# Altium project pumpPCB.PrjPcb
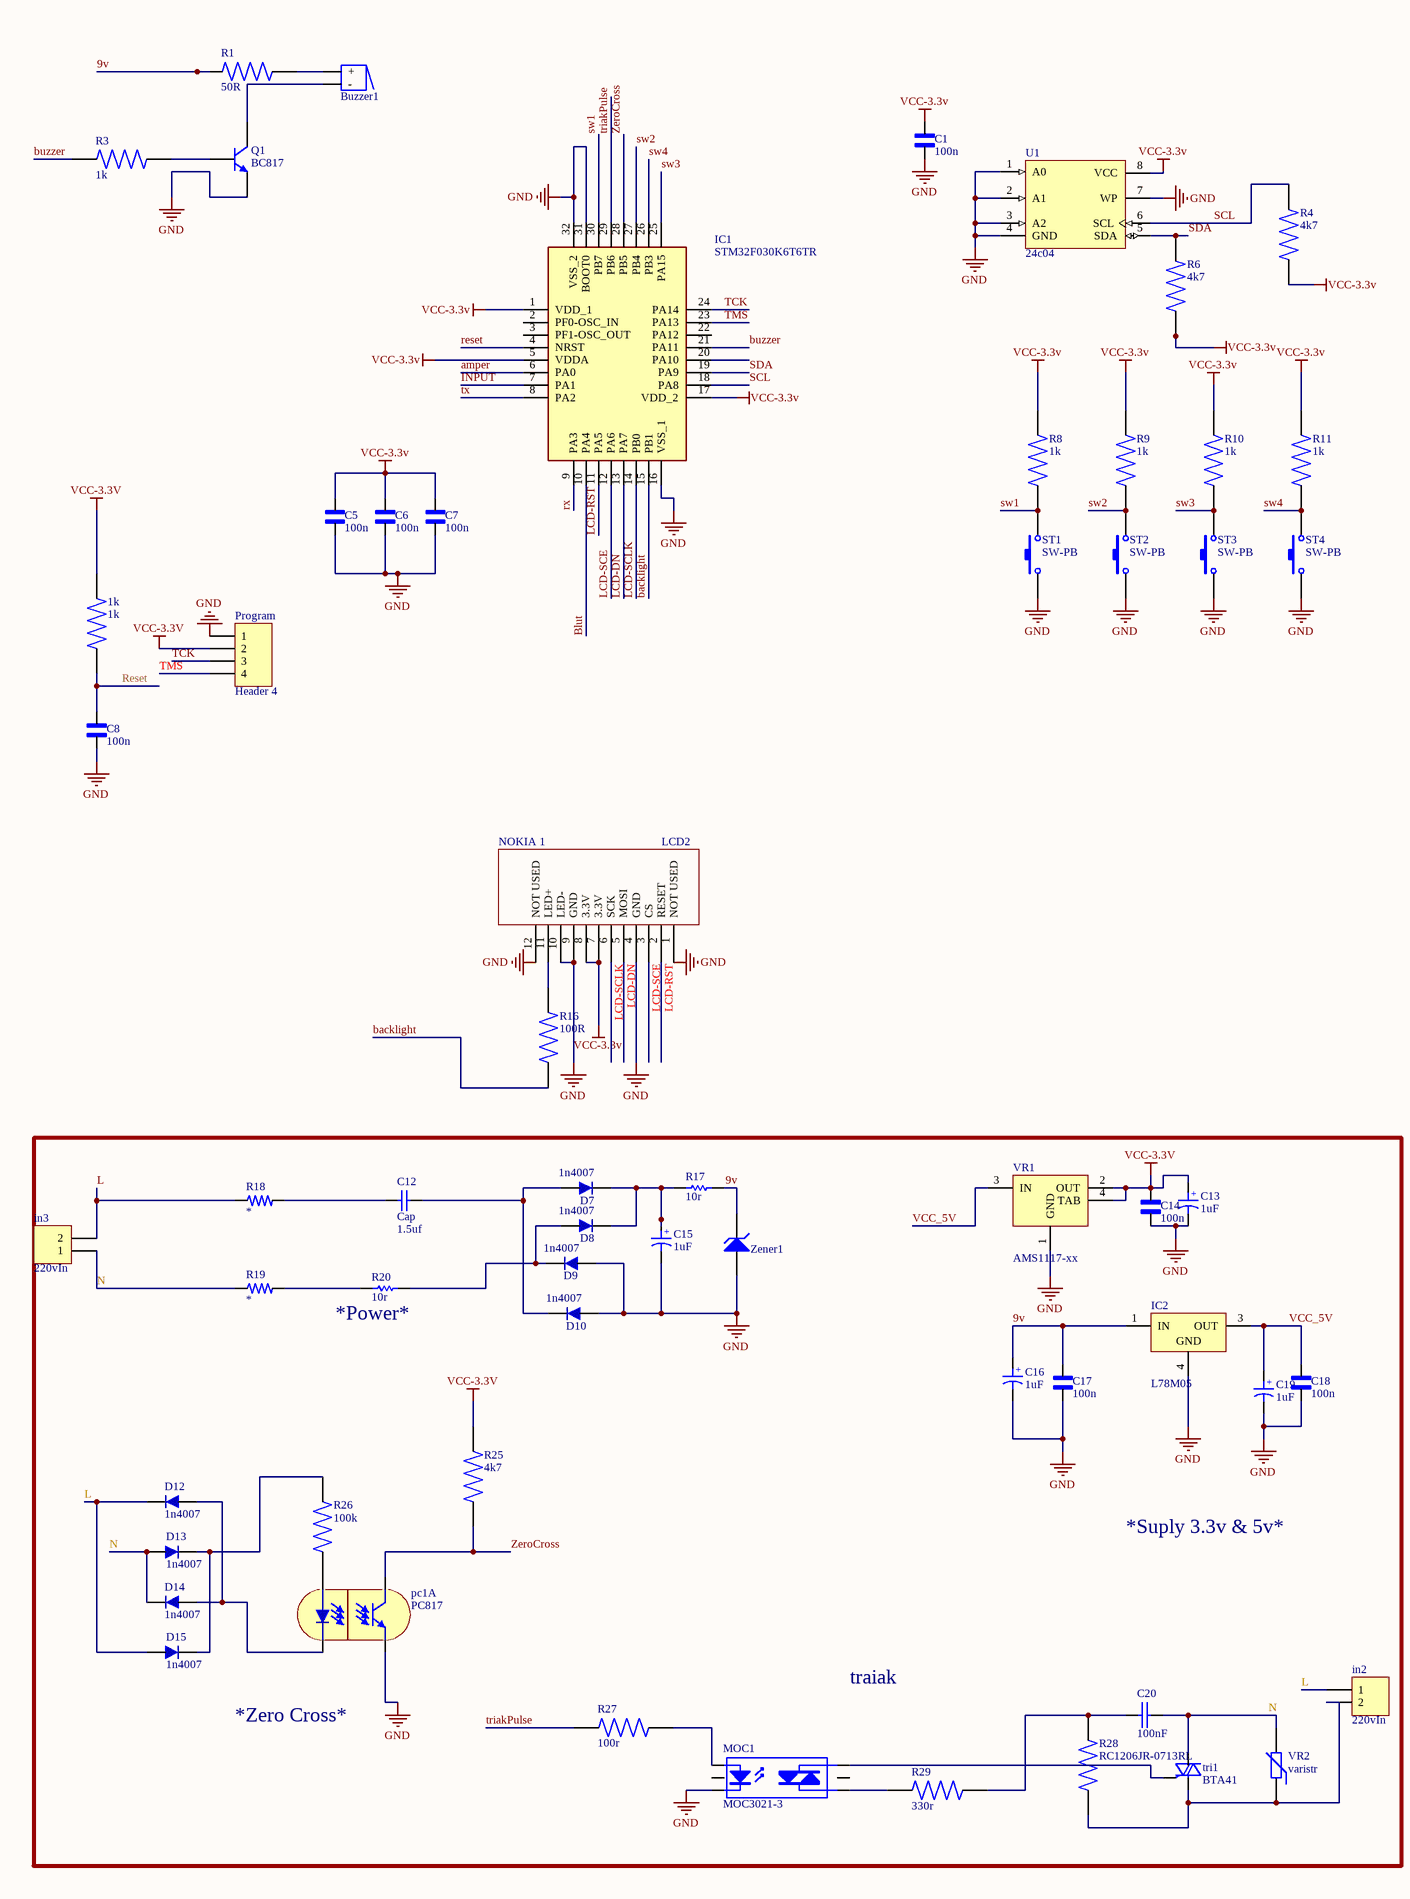
[diagram p0: LOAD CONTROL_Final2.SchDoc, left]
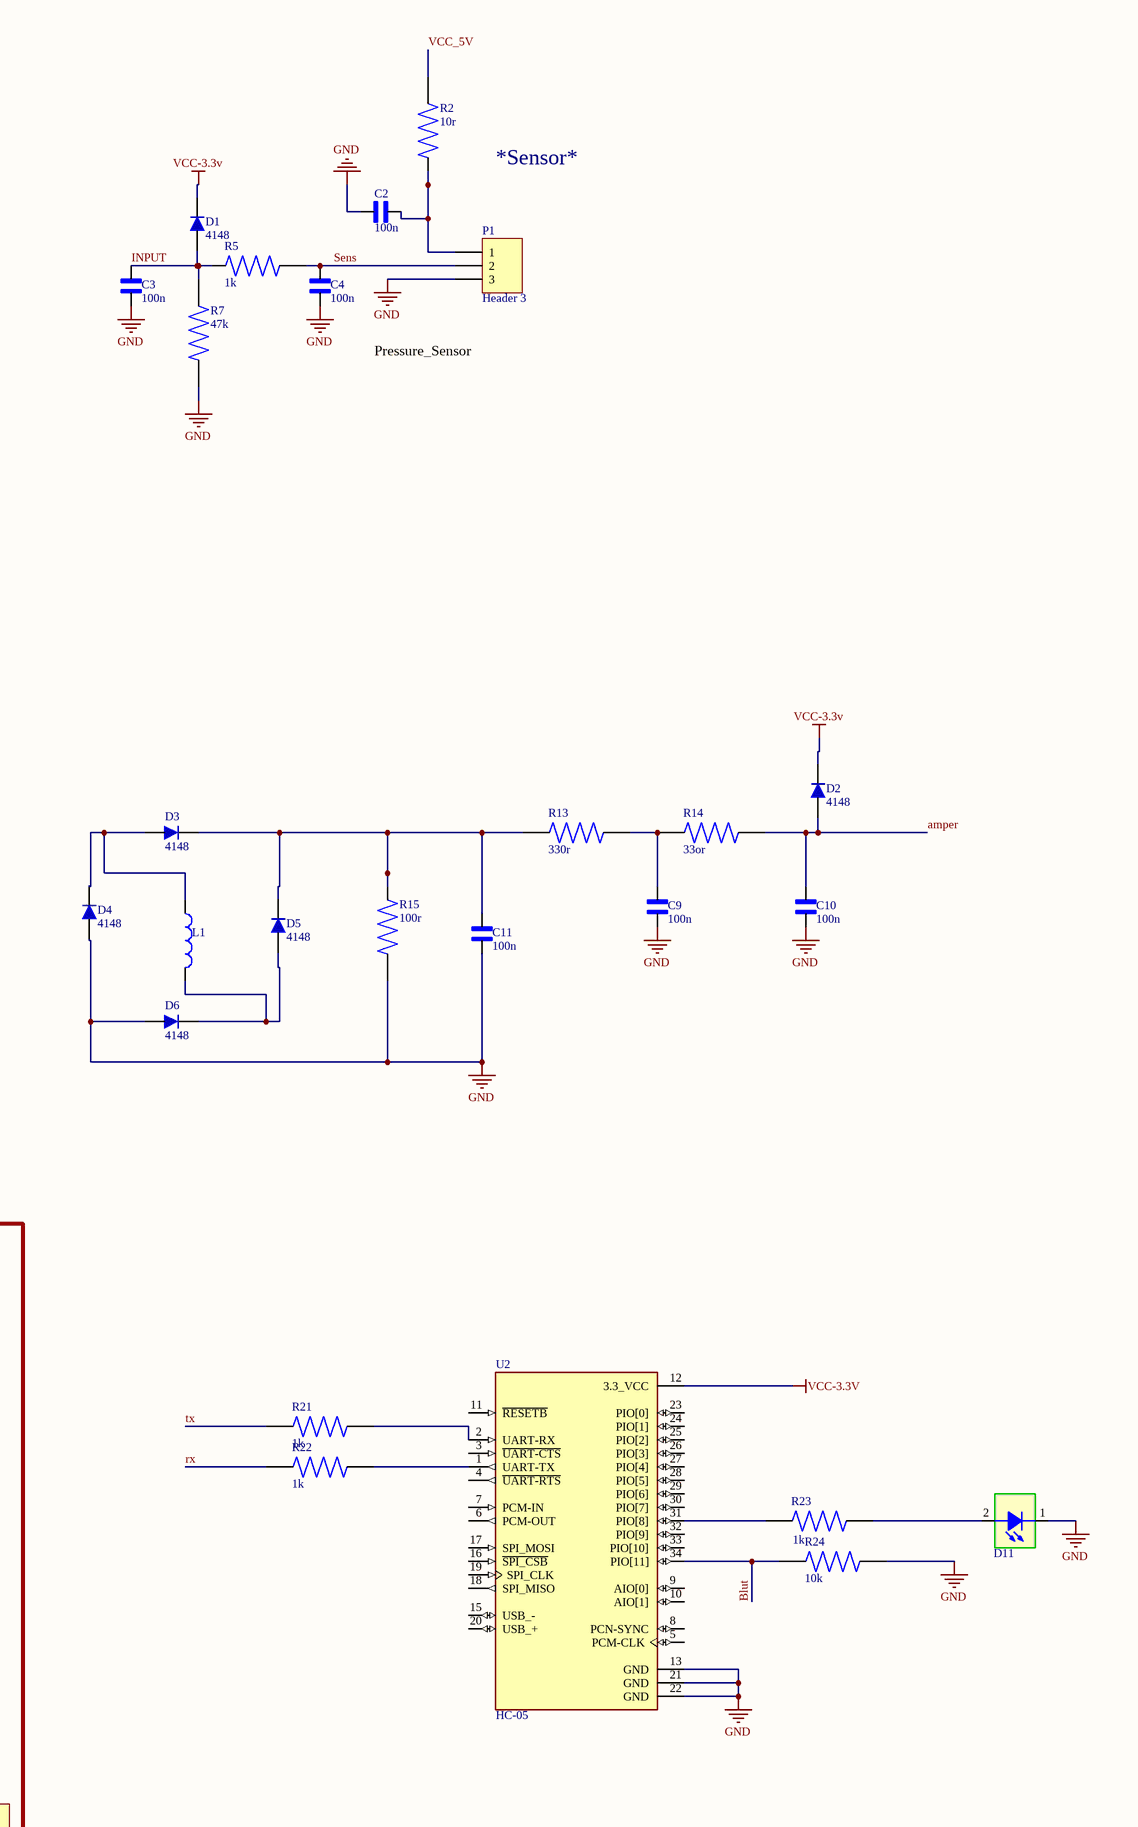
[diagram p1: LOAD CONTROL_Final2.SchDoc, right]
1 sheet, 86 parts. Net scope: global (net labels, ports and power ports of the same name join across sheets).
Board file: PumpControl.PcbDoc

## Sheet LOAD CONTROL_Final2.SchDoc
size A2

### Parts
1k  1k  [RESC3116X65N]
Buzzer1  Buzzer  [BUZZER]  (value not drawn)
C1  100n  [CAPC3216X88N]
C2  100n  [CAPC3216X88N]
C3  100n  [CAPC3216X88N]
C4  100n  [CAPC3216X88N]
C5  100n  [CAPC3216X88N]
C6  100n  [CAPC3216X88N]
C7  100n  [CAPC3216X88N]
C8  100n  [CAPC3216X88N]
C9  100n  [CAPC3216X88N]
C10  100n  [CAPC3216X88N]
C11  100n  [CAPC3216X88N]
C12  Cap  value 1.5uf  [RAD-0.3]
C13  1uF  [Cap electrolitic radial 5x11-2]
C14  100n  [CAPC3216X88N]
C15  1uF  [Cap electrolitic radial 5x11-2]
C16  1uF  [Cap electrolitic radial 5x11-2]
C17  100n  [CAPC3216X88N]
C18  100n  [CAPC3216X88N]
C19  1uF  [Cap electrolitic radial 5x11-2]
C20  100nF  [Cap 10nF]
D1  4148  [SOD80, LL-34]
D2  4148  [SOD80, LL-34]
D3  4148  [SOD80, LL-34]
D4  4148  [SOD80, LL-34]
D5  4148  [SOD80, LL-34]
D6  4148  [SOD80, LL-34]
D7  1n4007  [DIOM4629X24N]
D8  1n4007  [DIOM4629X24N]
D9  1n4007  [DIOM4629X24N]
D10  1n4007  [DIOM4629X24N]
D11  LED  [LED 1206]  (value not drawn)
D12  1n4007  [DIOM4629X24N]
D13  1n4007  [DIOM4629X24N]
D14  1n4007  [DIOM4629X24N]
D15  1n4007  [DIOM4629X24N]
IC1  STM32F030K6T6TR  [QFP80P900X900X160-32N]
IC2  L78M05  [TO-252]
in2  220vIn  [HDR1X2]
in3  220vIn  [HDR1X2]
L1  0  [ZMC]  (value not drawn)
MOC1  MOC3021-3  [DIP-6]
NOKIA_1  LCD2  [LCD NOKIA 1202]
P1  Header 3  [3PIN]
pc1  PC817  [SMT Gullwing Lead-Form]  (parts A,B of 2)
Program  Header 4  [HDR1X4]
Q1  BC817  [SOT23_N]
R1  50R  [RESC3116X65N]
R2  10r  [RESC3116X65N]
R3  1k  [RESC3116X65N]
R4  4k7  [RESC3116X65N]
R5  1k  [RESC3116X65N]
R6  4k7  [RESC3116X65N]
R7  47k  [RESC3116X65N]
R8  1k  [RESC3116X65N]
R9  1k  [RESC3116X65N]
R10  1k  [RESC3116X65N]
R11  1k  [RESC3116X65N]
R13  330r  [RESC3116X65N]
R14  33or  [RESC3116X65N]
R15  100r  [RESC3116X65N]
R16  100R  [RESC3116X65N]
R17  10r  [RES-(1/2)-Stand]
R18  100uh  [RESAD640W45L370D200]  (value not drawn)
R19  100uh  [RESAD640W45L370D200]  (value not drawn)
R20  10r  [RES-(1/2)-Stand]
R21  1k  [RESC3116X65N]
R22  1k  [RESC3116X65N]
R23  1k  [RESC3116X65N]
R24  10k  [RESC3116X65N]
R25  4k7  [RESC3116X65N]
R26  100k  [RESC3116X65N]
R27  100r  [RESC3116X65N]
R28  RC1206JR-0713RL  [RESC3116X65N]
R29  330r  [RESC3116X65N]
ST1  SW-PB  [PUSH BOTTOM 6*6]
ST2  SW-PB  [PUSH BOTTOM 6*6]
ST3  SW-PB  [PUSH BOTTOM 6*6]
ST4  SW-PB  [PUSH BOTTOM 6*6]
tri1  BTA41  [TO552P1530X450X2110-3B]
U1  24c04  [SO8_L]
U2  HC-05  [XCVR_HC-05]
VR1  AMS1117-xx  [SOT-223]
VR2  varistr  [14D XXX]
Zener1  9v  [Diode 1W_Stand]  (value not drawn)

### Nets
GND: C1.1 C2.2 C3.1 C4.1 C5.1 C6.1 C7.1 C8.1 C9.1 C10.1 C11.1 C13.2 C14.1 C15.2 C16.2 C17.1 C18.1 C19.2 D4.1 D6.1 D9.1 D10.1 D11.1 IC1.16(VSS_1) IC1.31(BOOT0) IC1.32(VSS_2) IC2.4(GND) MOC1.2(K) NOKIA_1.1(NOT_USED) NOKIA_1.4(GND) NOKIA_1.9(GND) NOKIA_1.10(LED-) NOKIA_1.12(NOT_USED) P1.3 pc1.3(E) Program.1 Q1.2(E) R7.1 R15.1 R24.1 ST1.1 ST2.1 ST3.1 ST4.1 U1.1(A0) U1.2(A1) U1.3(A2) U1.4(GND) U1.7(WP) U2.13(GND) U2.21(GND) U2.22(GND) VR1.1(GND) Zener1.1(A)
VCC-3.3v: 1k.2 C1.2 C5.2 C6.2 C7.2 C13.1 C14.2 D1.2 D2.2 IC1.1(VDD_1) IC1.5(VDDA) IC1.17(VDD_2) NOKIA_1.7(3.3V) NOKIA_1.8(3.3V) Program.2 R4.1 R6.1 R8.2 R9.2 R10.2 R11.2 R25.2 U1.8(VCC) U2.12(3.3_VCC) VR1.2(OUT) VR1.4(TAB)
9v: C16.1 C17.2 IC2.1(IN) R1.1 R17.2 Zener1.2(K)
amper: C10.2 D2.1 IC1.6(PA0) R14.1
backlight: IC1.15(PB1) R16.1
Blut: IC1.10(PA4) R24.2 U2.34(PIO[11])
buzzer: IC1.21(PA11) R3.1
INPUT: C3.2 D1.1 IC1.7(PA1) R5.2 R7.2
L: D12.2 D15.1 in2.1 in3.2 R18.1
LCD-DN: IC1.13(PA7) NOKIA_1.5(MOSI)
LCD-RST: IC1.11(PA5) NOKIA_1.2(RESET)
LCD-SCE: IC1.12(PA6) NOKIA_1.3(CS)
LCD-SCLK: IC1.14(PB0) NOKIA_1.6(SCK)
N: C20.2(-) D13.1 D14.2 in3.1 R19.1 tri1.2(A2) VR2.2
Reset: 1k.1 C8.2 IC1.4(NRST)
rx: IC1.9(PA3) R22.2
SCL: IC1.18(PA8) R4.2 U1.6(SCL)
SDA: IC1.19(PA9) R6.2 U1.5(SDA)
Sens: C4.2 P1.2 R5.1
sw1: IC1.30(PB7) R8.1 ST1.2
sw2: IC1.27(PB4) R9.1 ST2.2
sw3: IC1.25(PA15) R10.1 ST3.2
sw4: IC1.26(PB3) R11.1 ST4.2
TCK: IC1.24(PA14) Program.3
TMS: IC1.23(PA13) Program.4
triakPulse: IC1.29(PB6) R27.2
tx: IC1.8(PA2) R21.2
VCC_5V: C18.2 C19.1 IC2.3(OUT) R2.1 VR1.3(IN)
ZeroCross: IC1.28(PB5) pc1.4(C) R25.1
NetBuzzer1_1: Buzzer1.1(+) R1.2
NetBuzzer1_2: Buzzer1.2(-) Q1.3(C)
NetC2_1: C2.1 P1.1 R2.2
NetC9_2: C9.2 R13.1 R14.2
NetC11_2: C11.2 D3.2 D5.2 R13.2 R15.2
NetC12_1: C12.1 R18.2
NetC12_2: C12.2 D7.1 D10.2
NetC15_1: C15.1 D7.2 D8.2 R17.1
NetC20_1: C20.1(+) R28.1 R29.1
NetD3_1: D3.1 D4.2 L1.1
NetD5_1: D5.1 D6.2 L1.2
NetD8_1: D8.1 D9.2 R20.2
NetD11_2: D11.2 R23.1
NetD12_1: D12.1 D14.1 pc1.2(K)
NetD13_2: D13.2 D15.2 R26.2
Netin2_2: in2.2 R28.2 tri1.1(A1) VR2.1
NetMOC1_1: MOC1.1(A) R27.1
NetMOC1_4: MOC1.4(A/K) tri1.3(G)
NetMOC1_6: MOC1.6(A/K) R29.2
NetNOKIA_1_11: NOKIA_1.11(LED+) R16.2
Netpc1_1: pc1.1(A) R26.1
NetQ1_1: Q1.1(B) R3.2
NetR19_2: R19.2 R20.1
NetR21_1: R21.1 U2.2(UART-RX)
NetR22_1: R22.1 U2.1(UART-TX)
NetR23_2: R23.2 U2.31(PIO[8])

Not connected (* = marked no-connect by the designer): IC1 2(PF0-OSC_IN) 3(PF1-OSC_OUT) 20(PA10) 22(PA12); MOC1 3(NC) 5(NC); U2 3(~{UART-CTS}) 4(~{UART-RTS}) 5(PCM-CLK) 6(PCM-OUT) 7(PCM-IN) 8(PCN-SYNC) 9(AIO[0]) 10(AIO[1]) 11(~{RESETB}) 15(USB_-) 16(~{SPI_CSB}) 17(SPI_MOSI) 18(SPI_MISO) 19(SPI_CLK) 20(USB_+) 23(PIO[0]) 24(PIO[1]) 25(PIO[2]) 26(PIO[3]) 27(PIO[4]) 28(PIO[5]) 29(PIO[6]) 30(PIO[7]) 32(PIO[9]) 33(PIO[10])

### Notes on the sheet
- *Sensor*
- Pressure_Sensor
- (near R20) *Power*
- *Suply 3.3v & 5v*
- traiak
- *Zero Cross*
- (in symbol Cap ELECTROLITIC TOTAL SIZE) +

### Library data of the parts
1k R1-R11 R13-R16 R21-R29 = RC1206JR-0713RL: 13 Ohms Â±5% 0.25W, 1/4W Chip Resistor 1206 (3216 Metric) Moisture Resistant Thick Film; MF: Yageo; Check_prices: https://www.snapeda.com/parts/RC1206JR-0713RL/Yageo/view-part/?ref=eda; Value: *; Availability: In Stock; MP: RC1206JR-0713RL; Price: None; Package: 3116 Yageo; SnapEDA_Link: https://www.snapeda.com/parts/RC1206JR-0713RL/Yageo/view-part/?ref=snap; Purchase-URL: https://pricing.snapeda.com/search/part/RC1206JR-0713RL/?ref=eda
Buzzer1 = Buzzer: Designer: Seyed Mohsen Ghasemain; ComponentLinkURL: www.picpars.com
C1-C11 C14 C17 C18 = C1206C120J5GACTU: 1206 C 12pF Ceramic Multilayer Capacitor, 50 VDC, +125degC, C0G Dielec, +/-5% | KEMET C1206C120J5GACTU; SnapEDA_Link: https://www.snapeda.com/parts/C1206C120J5GACTU/KEMET/view-part/?ref=snap; Package: 3216 KEMET; Value: *; MF: KEMET; MP: C1206C120J5GACTU; Check_prices: https://www.snapeda.com/parts/C1206C120J5GACTU/KEMET/view-part/?ref=eda
C12 = Cap: Capacitor; Published: 8-Jun-2000; LatestRevisionDate: 17-Jul-2002; LatestRevisionNote: Re-released for DXP Platform.; PackageReference: RAD-0.3; Publisher: Altium Limited; PackageDescription: Radial Cap, Thru-Hole; 2 Leads; 0.3 in Pin Spacing
C13 C15 C16 C19 = Cap ELECTROLITIC TOTAL SIZE: Cap electrolitic radial; Designer: Abbas Basereh; Data: 16-12-2016; Part. No: *; VALUE: 1uF
C20 = Cap-Bipolar: Bipolar Capacitor; Voltage: 100V; Designer: Saeid Jorablo; Organazation: ControTec; Adding Date: 1387/12/20; Value: 100nF
D1-D6 = 1N4148UR-1: DIODE GEN PURP 75V 200MA DO213AA; Published: 2017-1-12; PackageVersion: 2017-1-12; PackageReference: DO-213AA&SOD-80; Publisher: Abbas Basereh; PackageDescription: DIODE GEN PURP 75V 200MA DO213AA; ComponentLink1Description: Manufacturer Link; ComponentLink1URL: http://www.digikey.com/product-detail/en/microsemi-corporation/1N4148UR-1/1N4148UR-1-ND/4377991; ComponentLink2Description: Datasheet; PART.NO: 1N4148UR-1
D7-D10 D12-D15 = 1n4007 SMD M7: Standard Rectifiers; Part. No: M7; Manufacturer: DC COMPONENTS; Designer: Abbas Basereh; Link: http://www.tme.eu/en/details/m7/smd-universal-diodes/dc-components/; Link: https://www.aliexpress.com/item/Smd-tube-1n4007-m7-SMA/1213719741.html?spm=2114.01010208.3.1.ZyZ7bC&ws_ab_test=searchweb0_0,searchweb201602_4_10065_10068_10084_10083_10080_10082_10081_10060_10061_10062_10056_10055_10054_10059_10099_10078_10079_427_10073_10103_10102_10096_10052_10050_10051,searchweb201603_4&btsid=db2be5ca-e560-400a-b91c-484ab5ee228b; Data: 16-12-2016
  D7: Value: 1n4007
D11 = LED SMD 1206: SMD 1206 LED
IC1 = STM32F030K6T6TR: Integrated Circuit; Manufacturer_Name: STMicroelectronics; Datasheet Link: http://www.st.com/content/ccc/resource/technical/document/datasheet/a4/5d/0b/0e/87/c4/4d/71/DM00088500.pdf/files/DM00088500.pdf/jcr:content/translations/en.DM00088500.pdf; Height: 1.6mm; Manufacturer_Part_Number: STM32F030K6T6TR; Mouser Part Number: 511-STM32F030K6T6TR; Mouser Price/Stock: https://www.mouser.co.uk/ProductDetail/STMicroelectronics/STM32F030K6T6TR/?qs=9MuLHSklicort60U4QZudQ%3D%3D; Arrow Part Number: STM32F030K6T6TR; Arrow Price/Stock: https://www.arrow.com/en/products/stm32f030k6t6tr/stmicroelectronics
IC2 = L78M05: Precision 500mA Regulator
in2 in3 = Header 2: Header, 2-Pin; LatestRevisionDate: 17-Jul-2002; LatestRevisionNote: Re-released for DXP Platform.; Publisher: Altium Limited
L1 = Inductor: Code_IEC: 1005; Value: 300uH; Published: 8-Jun-2000; LatestRevisionDate: 29-May-2009; LatestRevisionNote: IPC-7351 Footprint Added.; PackageReference: 0402-A; Publisher: Altium Limited; PackageDescription: Chip Inductor; Code_JEITA: 0402
MOC1 = MOC3021-3: Opto-Triac; Designer: Seyed Mohsen Ghasemian; E-mail: picpars@gmail.com; Published: 17-11-2011; LatestRevisionDate: 17-11-2011; Publisher: www.picpars.com; WEB: www.picpars.com
NOKIA_1 = NOKIA 1202
P1 = Header 3: Header, 3-Pin; LatestRevisionDate: 17-Jul-2002; LatestRevisionNote: Re-released for DXP Platform.; Publisher: Altium Limited
pc1 = PC817XI: DIP 4pin General Purpose  Photocoupler; Published: 2017-2-27; DatasheetVersion: 2017-2-27; PackageVersion: 2017-2-27; PackageReference: SMT Gullwing Lead-Form; Publisher: Abbas Basereh; PackageDescription: SOP, 4-Leads, Body 4/65x6/75mm, Pitch 2/54mm, IPC Medium Density designer:abbas basereh; ComponentLink1Description: Manufacturer Link; ComponentLink1URL: http://www.roboeq.ir/files/id/233/name/PC817.pdf/; ComponentLink2Description: DIP 4pin General Purpose
Program = Header 4: Header, 4-Pin; LatestRevisionDate: 17-Jul-2002; LatestRevisionNote: Re-released for DXP Platform.; Publisher: Altium Limited
Q1 = BC817: 45 V, 500 mA NPN general-purpose transistors; Published: 2017-2-8; LatestRevisionDate: 2017; LatestRevisionNote: IPC-7351 Footprint Added.; DatasheetVersion: 2017; PackageVersion: 2017-2-8; PackageReference: SOT23; Publisher: Abbas Basereh; PackageDescription: 3-Pin SOT-23 Package 0.95 mm Pitch, 2.3 mm Lead Span; ComponentLink1Description: Manufacturer Link; ComponentLink1URL: http://www.nxp.com/; ComponentLink2Description: Datasheet; ComponentLink2URL: http://www.nxp.com/
R17 R20 = RES DIP PACKAGE: TOTAL DIP RESISTOR PACK; Designer: Ali Hafizi; Value: 10r
R18 R19 = LR0204F13K3: 13.3 kOhms Â±1% 0.25W, 1/4W Through Hole Resistor Axial - Metal Film; MF: TE Connectivity Passive Product; SnapEDA_Link: https://www.snapeda.com/parts/LR0204F13K3/TE/view-part/?ref=snap; Package: Axial TE Connectivity Passive Product; Value: *; MP: LR0204F13K3; Check_prices: https://www.snapeda.com/parts/LR0204F13K3/TE/view-part/?ref=eda; Comment_1: *
ST1-ST4 = SW-PB: Switch; Published: 24-Mar-1999; LatestRevisionDate: 17-Jul-2002; LatestRevisionNote: Re-released for DXP Platform.; PackageReference: SPST-2; Publisher: Altium Limited; PackageDescription: Switch; 2 Leads
tri1 = BTA41-600A: Thyristors, Discretes (diodes, transistors, thyristors ...), Semiconductors and Actives, original, triac, thyristors; MF: STMicroelectronics; SnapEDA_Link: https://www.snapeda.com/parts/BTA41-600A/STMicroelectronics/view-part/?ref=snap; Package: TOP-3 STMicroelectronics; Value: *; MP: BTA41-600A; Check_prices: https://www.snapeda.com/parts/BTA41-600A/STMicroelectronics/view-part/?ref=eda
U1 = AT24C512: EEPROM
U2 = HC-05: Bluetooth to Serial Port Module; MF: ITead Studio; SnapEDA_Link: https://www.snapeda.com/parts/HC-05/ITEAD/view-part/?ref=snap; Package: Module ITead Studio; Value: *; MP: HC-05; Check_prices: https://www.snapeda.com/parts/HC-05/ITEAD/view-part/?ref=eda
VR1 = AMS1117
VR2 = VARISTOR (VDR): VARISTORS; Manufacturer: china-canada-philipina; Designer: Abbas Basereh; VALUE: xxDxxx; Models: MOV-VDR-COV; Data: 2017-1-5; Link: digikey.com; PUBLISHER: ABBAS BASEREH
Zener1 = Diode Zener: Zener Diode; Designer: Saeid Jorablo; Company: E.P.I.L; Voltage: 3.3 V; Design Date: 2011/11/02